# Altium schematic sheet IRS2092 CONTROLLER.SchDoc
size A3; CheckedBy: Alain.Zhu; CompanyName: TYMPHANY; DrawnBy: Yetta.He; Organization: PABU-BL3; Address1: 11F,block A, CEC building,; Address2: No.2070 Shennan Zhong road,; Address3: Huaqiang North, Futian District,; Address4: Shenzhen,  Guang Dong, P.R.C 518000; DocumentNumber: 6; Revision: 1.0.0; SheetNumber: 6; SheetTotal: 8; Size: A3; PCB By: Yetta.He; Status: DP1.1
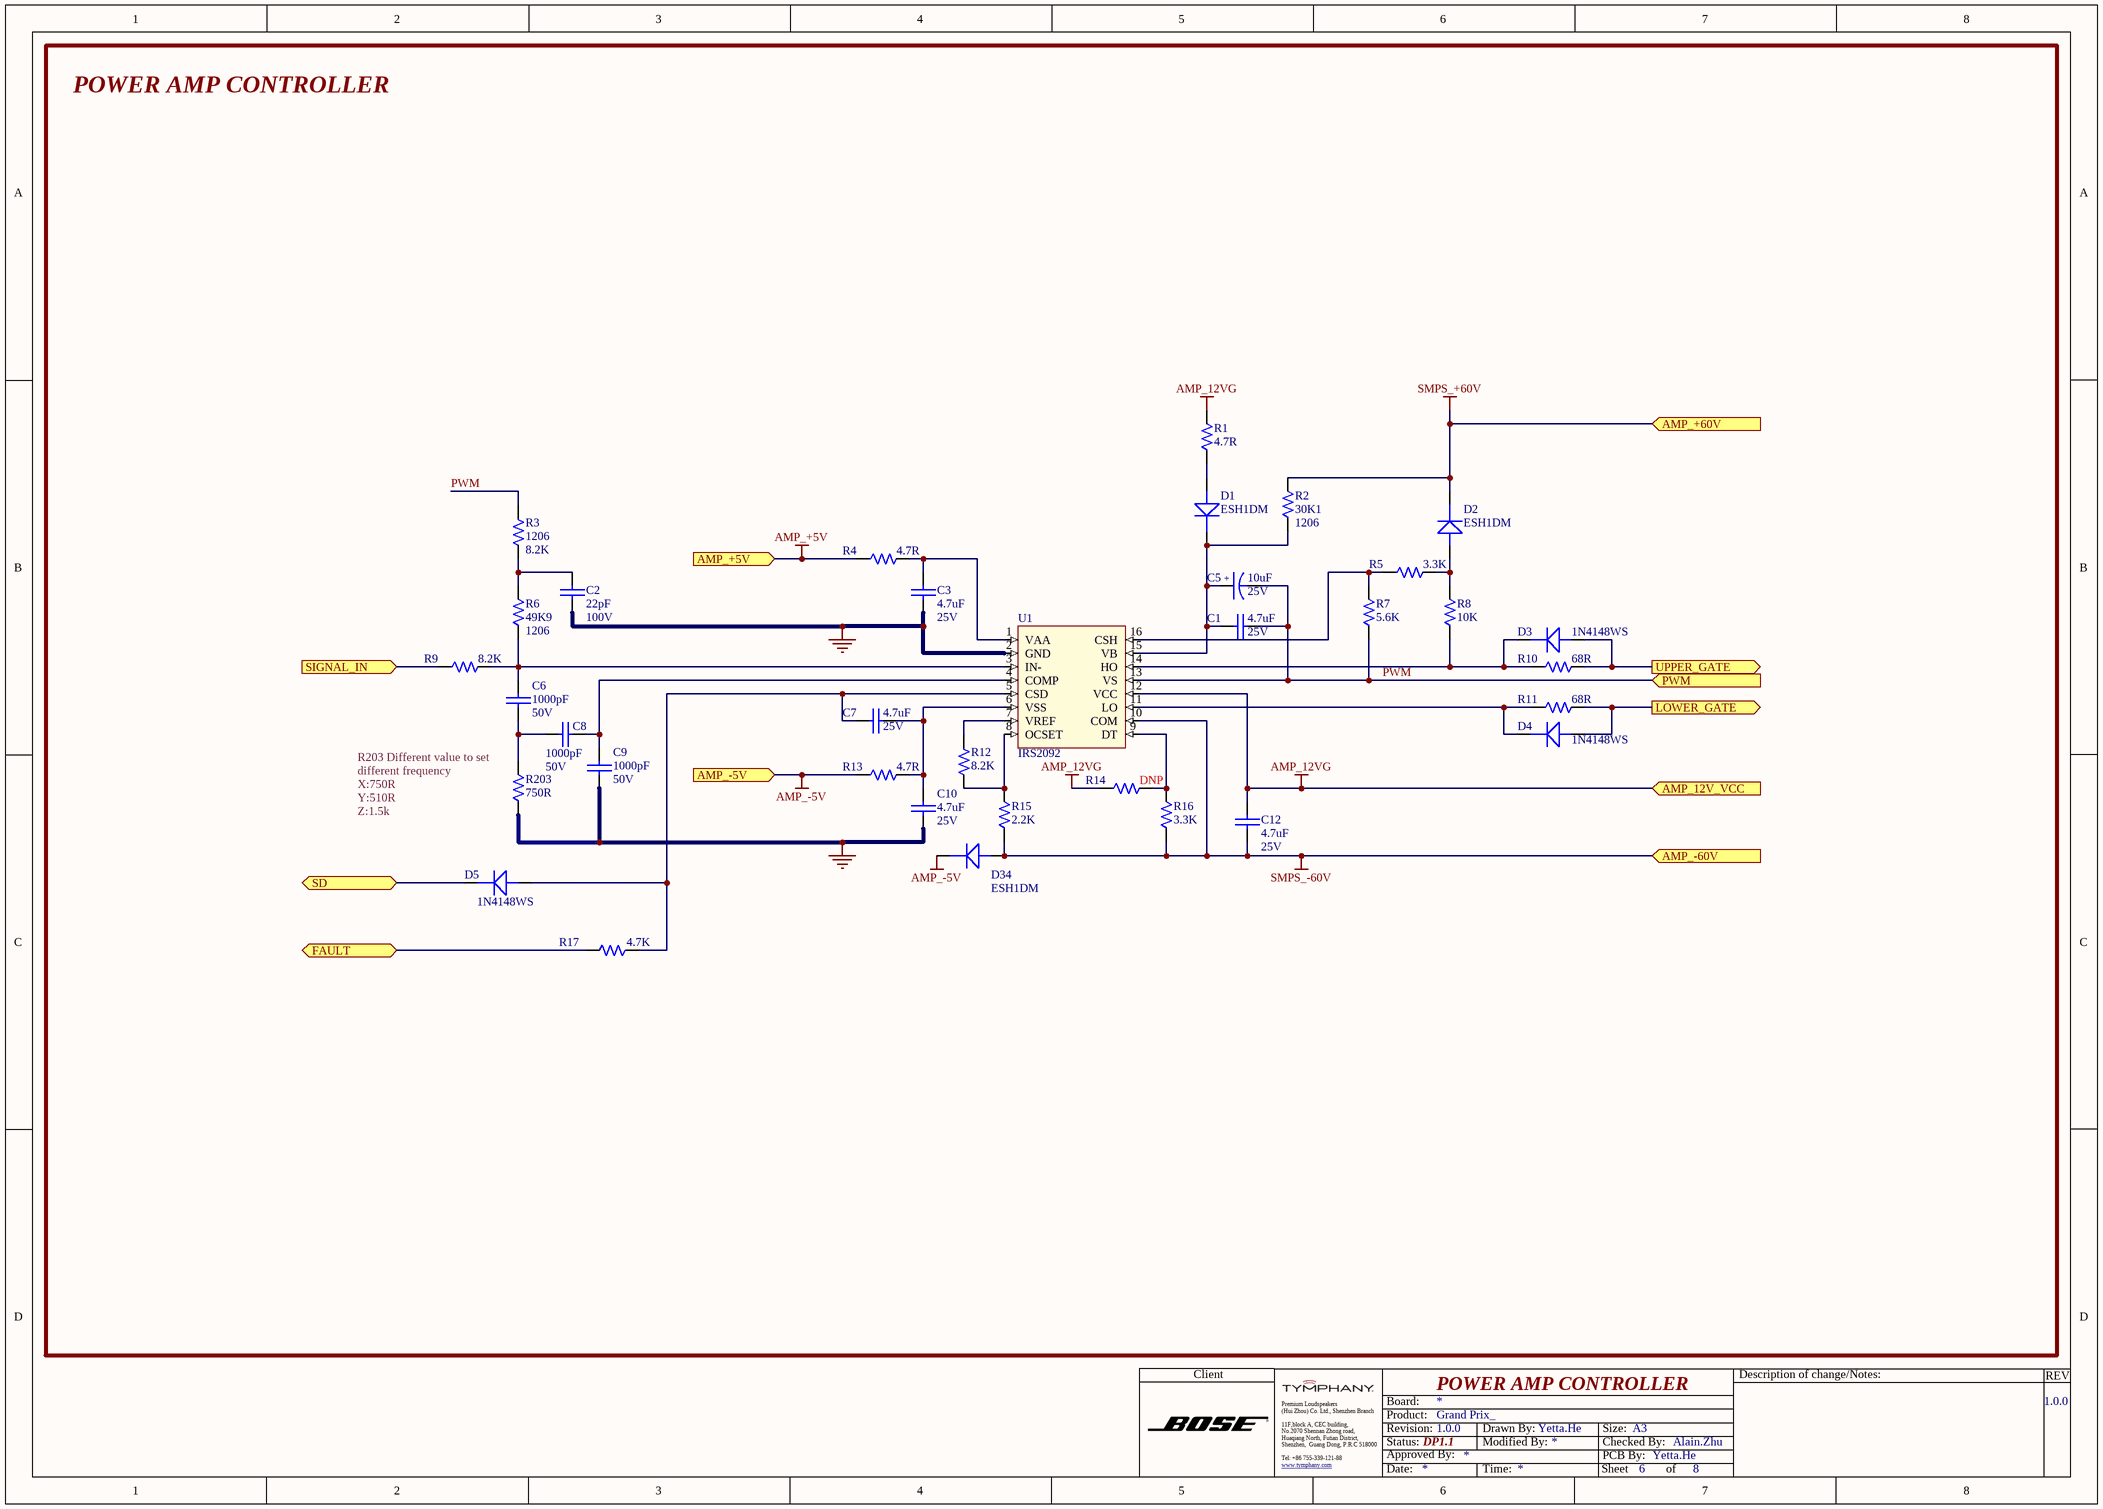
[diagram p0: IRS2092 CONTROLLER.SchDoc]

## Parts
C1  value 4.7uF  Voltage: 25V  [CAPC0603-RW]  (hidden comment: T542024757408)
C2  value 22pF  Voltage: 100V  [CAPC0805-RW]  (hidden comment: PYL4103A0-2200)
C3  value 4.7uF  Voltage: 25V  [CAPC0603-RW]  (hidden comment: T542024757408)
C5  value 10uF  Voltage: 25V  [CASE - B]  (hidden comment: T551100435040)
C6  value 1000pF  Voltage: 50V  [CAPC0603-RW]  (hidden comment: PXL410370-1020)
C7  value 4.7uF  Voltage: 25V  [CAPC0603-RW]  (hidden comment: T542024757408)
C8  value 1000pF  Voltage: 50V  [CAPC0603-RW]  (hidden comment: PXL410370-1020)
C9  value 1000pF  Voltage: 50V  [CAPC0603-RW]  (hidden comment: PXL410370-1020)
C10  value 4.7uF  Voltage: 25V  [CAPC0603-RW]  (hidden comment: T542024757408)
C12  value 4.7uF  Voltage: 25V  [CAPC0603-RW]  (hidden comment: T542024757408)
D1  T571002680204  [Micro SMA]  (value not drawn)
D2  T571002680204  [Micro SMA]  (value not drawn)
D3  RCD114148-0020  [SOD-323]  (value not drawn)
D4  RCD114148-0020  [SOD-323]  (value not drawn)
D5  RCD114148-0020  [SOD-323]  (value not drawn)
D34  T571002680204  [Micro SMA]  (value not drawn)
R1  value 4.7R  [0805-RW]  (hidden comment: QCF081020-4708)
R2  value 30K1  PACKAGE: 1206  [1206-RW]  (hidden comment: T502301204399)
R3  value 8.2K  Package: 1206  [1206-RW]  (hidden comment: T502820104399)
R4  value 4.7R  [0603-RW]  (hidden comment: QCF011030-4708)
R5  value 3.3K  [0603-RW]  (hidden comment: QCF011030-3301)
R6  value 49K9  PACKAGE: 1206  [1206-RW]  (hidden comment: T502499204399)
R7  value 5.6K  [0603-RW]  (hidden comment: QCF011030-5601)
R8  value 10K  [0603-RW]  (hidden comment: QCF011030-1002)
R9  value 8.2K  [0603-RW]  (hidden comment: QCF011030-8201)
R10  value 68R  [0805-RW]  (hidden comment: QCF081020-6809)
R11  value 68R  [0805-RW]  (hidden comment: QCF081020-6809)
R12  value 8.2K  [0603-RW]  (hidden comment: QCF011030-8201)
R13  value 4.7R  [0603-RW]  (hidden comment: QCF011030-4708)
R14  value DNP  [0603-RW]  (hidden comment: RES0603 NC)
R15  value 2.2K  [0603-RW]  (hidden comment: QCF011030-2201)
R16  value 3.3K  [0603-RW]  (hidden comment: QCF011030-3301)
R17  value 4.7K  [0603-RW]  (hidden comment: QCF011030-4701)
R203  value 750R  [0603-RW]  (hidden comment: QCF011030-7500)
U1  RCI002092-0001  [SO16]  (value not drawn)

## Ports
AMP_12V_VCC (in), AMP_+5V (in), AMP_+60V (in), AMP_-5V (in), AMP_-60V (in), FAULT (bidir), LOWER_GATE (out), PWM (in), SD (bidir), SIGNAL_IN (in), UPPER_GATE (out)

## Nets
AMP_12VG: C12.1 R1.2 R14.1 U1.12(VCC) ; port AMP_12V_VCC
AMP_+5V: R4.1 ; port AMP_+5V
AMP_-5V: D34.2(K) R13.1 ; port AMP_-5V
GND: C2.2 C3.2 C9.2 C10.2 R203.1 U1.2(GND)
SMPS_+60V: D2.2(K) R2.2 ; port AMP_+60V
SMPS_-60V: C12.2 D34.1(A) R15.1 R16.1 U1.10(COM) ; port AMP_-60V
FAULT: R17.2 ; port FAULT
LOWER_GATE: D4.1(A) R11.2 ; port LOWER_GATE
PWM: C1.2 C5.2 R3.1 R7.1 U1.13(VS) ; port PWM
SD: D5.2(K) ; port SD
SIGNAL_IN: R9.1 ; port SIGNAL_IN
UPPER_GATE: D3.1(A) R10.2 ; port UPPER_GATE
NetC1_1: C1.1 C5.1 D1.2(K) R2.1 U1.15(VB)
NetC2_1: C2.1 R3.2 R6.2
NetC3_1: C3.1 R4.2 U1.1(VAA)
NetC6_1: C6.1 R6.1 R9.2 U1.3(IN-)
NetC6_2: C6.2 C8.1 R203.2
NetC7_1: C7.1 D5.1(A) R17.1 U1.5(CSD)
NetC7_2: C7.2 C10.1 R13.2 U1.6(VSS)
NetC8_2: C8.2 C9.1 U1.4(COMP)
NetD1_1: D1.1(A) R1.1
NetD2_1: D2.1(A) R5.2 R8.2
NetD3_2: D3.2(K) R8.1 R10.1 U1.14(HO)
NetD4_2: D4.2(K) R11.1 U1.11(LO)
NetR5_1: R5.1 R7.2 U1.16(CSH)
NetR12_1: R12.1 U1.7(VREF)
NetR12_2: R12.2 R15.2 U1.8(OCSET)
NetR14_2: R14.2 R16.2 U1.9(DT)

## Notes on the sheet
- POWER AMP CONTROLLER
- (near R203) R203 Different value to set different frequency
  X:750R
  Y:510R
  Z:1.5k
- Client
- Description of change/Notes:
- REV
- Premium Loudspeakers
- (Hui Zhou) Co. Ltd., Shenzhen Branch
- Tel: +86 755-339-121-88
- Board:
- Status:
- Revision:
- Product:
- Approved By:
- Grand Prix_
- Drawn By:
- Modified By:
- Checked By:
- PCB By:
- Size:
- www.tymphany.com <http://www.tymphany.com>
- Date:
- Time:
- Sheet
- of
- (in symbol CAP E 10uF 25V 20% SMD_VEJ100M1ETR-0405) +

## Library data of the parts
C1 C3 C7 C10 C12 = CAP0603 4.7uF 25V 10%_X7R_WALSIN: CAP X7R 4.7UF 25V +-10% 0603 WALSIN L; Tolerance: 10%; Type: Capacitor; CREATE_NAME: Nathan; DIP&SMD: SMD; SAP: T542024757408; PACKAGE: CAPC0603; Vendor Name: *; MFG: WALSIN; MFG Part: *; Other: X7R; CREATE_TIME: 13-July-2016; Customer Specific: N/A
C2 = CAPC0805 22pF 100V 5%_NPO_WALSIN: CAP NPO 22PF 100V +-5% 0805 WALSIN L; SAP: T541032206608; Tolerance: 5%; Type: Capacitor; DIP&SMD: SMD; CREATE_NAME: Nathan; PACKAGE: CAPC0805; Vendor Code: *; Vendor Name: *; MFG: WALSIN; MFG Part: *; Other: NPO; Customer Specific: N/A; CREATE_TIME: 06-Aug-2016
C5 = CAP E 10uF 25V 20% SMD_VEJ100M1ETR-0405: E 10UF 25V +-20% 4.3X5 VEJ100M1E; MFG: LELON; Type: Capacitor; CREATE_NAME: Cherry; CREATE_TIME: 20190401; DIP&SMD: SMD; SAP: *; MFG Part: VEJ100M1ETR-0405; Other: *; Customer Specific: N/A; PACKAGE: CASE - B
C6 C8 C9 = CAP0603 1000pF 50V 5% - PXL410370-1020: CHIP CAP 1000pF 50V 5% 0603 TYPE NPO; SAP: T541021026508; Vendor Code: 10010262; Vendor Name: 东莞市晴远电子有限公司; Type: Capacitor; DIP&SMD: SMD; PACKAGE: CAPC0603; MFG: *; MFG Part: *; Other: NPO; Tolerance: 5%; Customer Specific: N/A
D1 D2 D34 = ESH1DM: DIODE 200V 1.0A ESH1DM TSC G; Current: 1A; CREATE_NAME: Tom; DIP&SMD: SMD; MFG: TSC; SAP: T571002680204; Vendor Name: *; Vendor Code: *; Voltage: 200V; Type: DIODE; CREATE_TIME: 19-Jul-2016; Package: Micro SMA; Customer Specific: N/A; MFG Part: ESH1DM
D3-D5 = 1N4148WS: DIODE SW 1N4148 VF=0.7V SOD-323; MFG: TW SEMICONDUCTOR; SAP: T572005070208; Voltage: 100V; Current: 150MA; DIP&SMD: SMD; Vendor Name: *; Vendor Code: *; Type: DIODE; Package: SOD-323; Customer Specific: N/A; MFG Part: 1N4148WS
R1 = RES0805 1/8W 1% 4.7 OHM: GP CHIP RES 4.7 OHM 1/8W 1% 0805; Vendor Code: 10010262; SAP: T502470B03399; Vendor Name: 东莞市晴远电子有限公司; DIP&SMD: SMD; Power: 1/8W; MFG Part: *; MFG: *; TOL: 1%; Type: Resistor; PACKAGE: 0805; Customer Specific: N/A
R2 = RES1206 1/4W 1% 30.1K OHM_WALSIN: CHIP 30.1K OHM 100PPM +-1% 1206 WALS L; Power: 1/4W; MFG: WALSIN (華新); TOL: 1%; CREATE_NAME: Nathan; DIP&SMD: SMD; Vendor Code: *; SAP: T502301204399; Vendor Name: *; MFG Part: *; Type: Resistor; CREATE_TIME: 03-July-2016; Customer Specific: N/A
R3 = RES1206 1/4W 1% 8.2K OHM: CHIP 8.2K OHM 100PPM +-1% 1206 WALS L; MFG Part: WR12X8201FTL; TOL: 1%; MFG: WALSIN; Power: 1/4W; CREATE_NAME: Tom; DIP&SMD: SMD; SAP: T502820104399; Vendor Code: *; Vendor Name: *; Type: Resistor; CREATE_TIME: 12-Apr-2016; Customer Specific: N/A
R4 R13 = RES0603 1/10W 1% 4.7 OHM: CHIP RES. 4.7 OHM 1/10W 1% 0603; Vendor Code: 10010262; SAP: T502470B02399; Vendor Name: 东莞市晴远电子有限公司; DIP&SMD: SMD; Power: 1/10W; MFG Part: *; MFG: *; TOL: 1%; Type: Resistor; PACKAGE: 0603; Customer Specific: N/A
R5 R16 = RES0603 1/10W 1% 3.3K OHM: GP CHIP RES. 3.3K OHM 1/10W 1% 0603; Vendor Code: 10010262; SAP: T502330102399; Vendor Name: 东莞市晴远电子有限公司; DIP&SMD: SMD; Power: 1/10W; MFG Part: *; MFG: *; TOL: 1%; Type: Resistor; PACKAGE: 0603; Customer Specific: N/A
R6 = RES1206 1/4W 1% 49.9K OHM_WALSIN: CHIP 49.9K OHM 100PPM +-1% 1206 WALS L; Power: 1/4W; MFG: WALSIN (華新); TOL: 1%; CREATE_NAME: Nathan; DIP&SMD: SMD; Vendor Code: *; SAP: T502499204399; Vendor Name: *; MFG Part: *; Type: Resistor; CREATE_TIME: 03-July-2016; Customer Specific: N/A
R7 = RES0603 1/10W 1% 5.6K OHM: GP CHIP RES. 5.6K OHM 1/10W 1% 0603; Vendor Code: 10010262; SAP: T502560102399; Vendor Name: 东莞市晴远电子有限公司; DIP&SMD: SMD; Power: 1/10W; MFG Part: *; MFG: *; TOL: 1%; Type: Resistor; PACKAGE: 0603; Customer Specific: N/A
R8 = RES0603 1/10W 1% 10K OHM: GP CHIP RES. 10K OHM 1/10W 1% 0603; Vendor Code: 10010262; SAP: T502100202399; Vendor Name: 东莞市晴远电子有限公司; DIP&SMD: SMD; Power: 1/10W; MFG Part: *; MFG: *; TOL: 1%; Type: Resistor; PACKAGE: 0603; Customer Specific: N/A
R9 R12 = RES0603 1/10W 1% 8.2K OHM: GP CHIP RES. 8.2K OHM 1/10W 1% 0603; Vendor Code: 10010262; SAP: T502820102399; Vendor Name: 东莞市晴远电子有限公司; DIP&SMD: SMD; Power: 1/10W; MFG Part: *; MFG: *; TOL: 1%; Type: Resistor; PACKAGE: 0603; Customer Specific: N/A
R10 R11 = RES0805 1/8W 1% 68 OHM: GP CHIP RES. 68 OHM 1/8W 1% 0805; SAP: T502680A03399; MFG: WALSIN; DIP&SMD: SMD; Vendor Code: *; Power: 1/8W; Vendor Name: *; MFG Part: *; TOL: 1%; Type: Resistor; PACKAGE: 0805; Customer Specific: N/A
R14 = RES0603 NC: NC; CREATE_NAME: Tom; DIP&SMD: SMD; SAP: *; Tolerance: *; MFG Part: *; MFG: *; Vendor Code: *; Vendor Name: *; Type: Resistor; Power: *; CREATE_TIME: 18-Mar-2016; Customer Specific: N/A; Package: 0603
R15 = RES0603 1/10W 1% 2.2K OHM: GP CHIP RES. 2.2K OHM 1/10W 1% 0603; Vendor Code: 10010262; SAP: T502220102399; Vendor Name: 东莞市晴远电子有限公司; DIP&SMD: SMD; Power: 1/10W; MFG Part: *; MFG: *; TOL: 1%; Type: Resistor; PACKAGE: 0603; Customer Specific: N/A
R17 = RES0603 1/10W 1% 4.7K OHM: GP CHIP RES. 4.7K OHM 1/10W 1% 0603; Vendor Code: 10010262; SAP: T502470102399; Vendor Name: 东莞市晴远电子有限公司; DIP&SMD: SMD; Power: 1/10W; MFG: *; MFG Part: *; TOL: 1%; Type: Resistor; PACKAGE: 0603; Customer Specific: N/A
R203 = RES0603 1/10W 1% 750 OHM: GP CHIP RES. 750 OHM 1/10W 1% 0603; Vendor Code: 10010262; SAP: T502750002399; Vendor Name: 东莞市晴远电子有限公司; DIP&SMD: SMD; Power: 1/10W; MFG Part: *; MFG: *; TOL: 1%; Type: Resistor; PACKAGE: 0603; Customer Specific: N/A
U1 = IRS2092: IC 16P IRS2092S SOIC16N; MFG: IR; Vendor Code: 10020441; Vendor Name: FUTURE ELECTRONICS (HONG KONG) LIMI; SAP: T610500027638; DIP&SMD: SMD; Type: IC; Customer Specific: N/A; MFG Part: IRS2092